# EAGLE design latch_circuit (EAGLE 9.5.2)
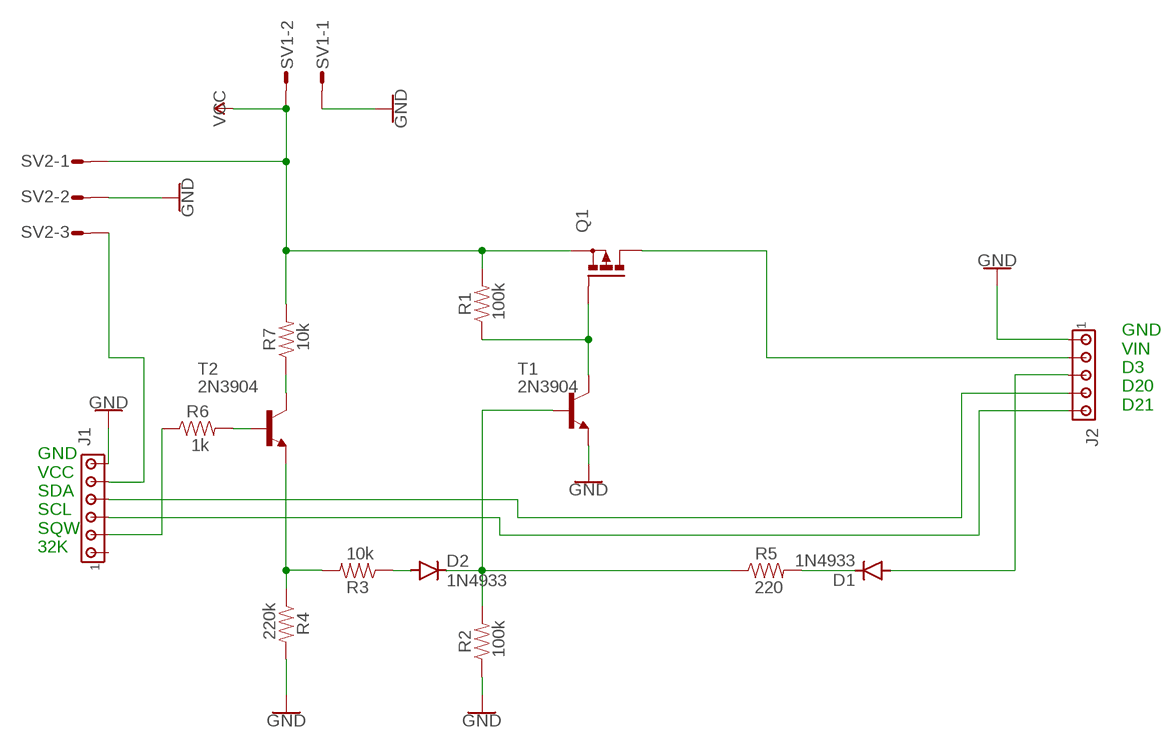
[diagram p0: schematic, sheet 1]

## Parts
D1  1N4933  [DO41-10]
D2  1N4933  [DO41-10]
J1  MTA06-100  [10X06MTA]
J2  MTA05-100  [10X05MTA]
Q1  PMOSFET_PTO220BH  [TO220BH]
R1  100k  RESISTORAXIAL-0.3  [AXIAL-0.3]
R2  100k  RESISTORAXIAL-0.3  [AXIAL-0.3]
R3  10k  RESISTORAXIAL-0.3  [AXIAL-0.3]
R4  220k  RESISTORAXIAL-0.3  [AXIAL-0.3]
R5  220  RESISTORAXIAL-0.3  [AXIAL-0.3]
R6  1k  RESISTORAXIAL-0.3  [AXIAL-0.3]
R7  10k  RESISTORAXIAL-0.3  [AXIAL-0.3]
SV1  S02P  [S02P]
SV2  S03P  [S03P]
T1  2N3904  [TO92]
T2  2N3904  [TO92]

## Nets
GND [New Class]: J1.6 J2.1 R2.P$1 R4.P$2 SV1.1 SV2.2 T1.3(E)
N$1 [New Class]: Q1.G R1.P$1 T1.1(C)
N$2 [New Class]: D2.A R3.P$1
N$3 [New Class]: J2.2 Q1.D
N$4 [New Class]: D2.C R2.P$2 R5.P$1 T1.2(B)
N$5 [New Class]: D1.C R5.P$2
N$6 [New Class]: D1.A J2.3
N$7: J1.2 R6.P$1
N$8 [New Class]: J1.5 SV2.3
N$9 [New Class]: J1.4 J2.4
N$10 [New Class]: J1.3 J2.5
N$11: R7.P$1 T2.1(C)
N$12: R6.P$2 T2.2(B)
N$13: R3.P$2 R4.P$1 T2.3(E)
VCC [New Class]: Q1.S R1.P$2 R7.P$2 SV1.2 SV2.1
Unconnected: J1.1

## Notes on the sheet
- GND
  VIN
  D3
  D20
  D21
- GND
  VCC
  SDA
  SCL
  SQW
  32K

## Library data of the parts
D1 D2 = diode:1N4933: DIODE fast recovery rectifier, 1A
J1 = con-amp:MTA06-100: AMP connector Connection corrected 2014-09-19
J2 = con-amp:MTA05-100: AMP connector
Q1 = transistor-power:PMOSFET_P: Power MOSFET P-Channel
R1-R7 = SparkFun-Resistors:RESISTOR: Generic Resistor Package
SV1 = con-amp-mt:S02P: AMP MT CONNECTOR; OC_FARNELL: unknown; OC_NEWARK: unknown
SV2 = con-amp-mt:S03P: AMP MT CONNECTOR; OC_FARNELL: unknown; OC_NEWARK: unknown
T1 T2 = transistor:2N3904: NPN TRANSISTOR

## Net classes
1 New Class: width 0.762 mm, clearance 0.508 mm

## Board
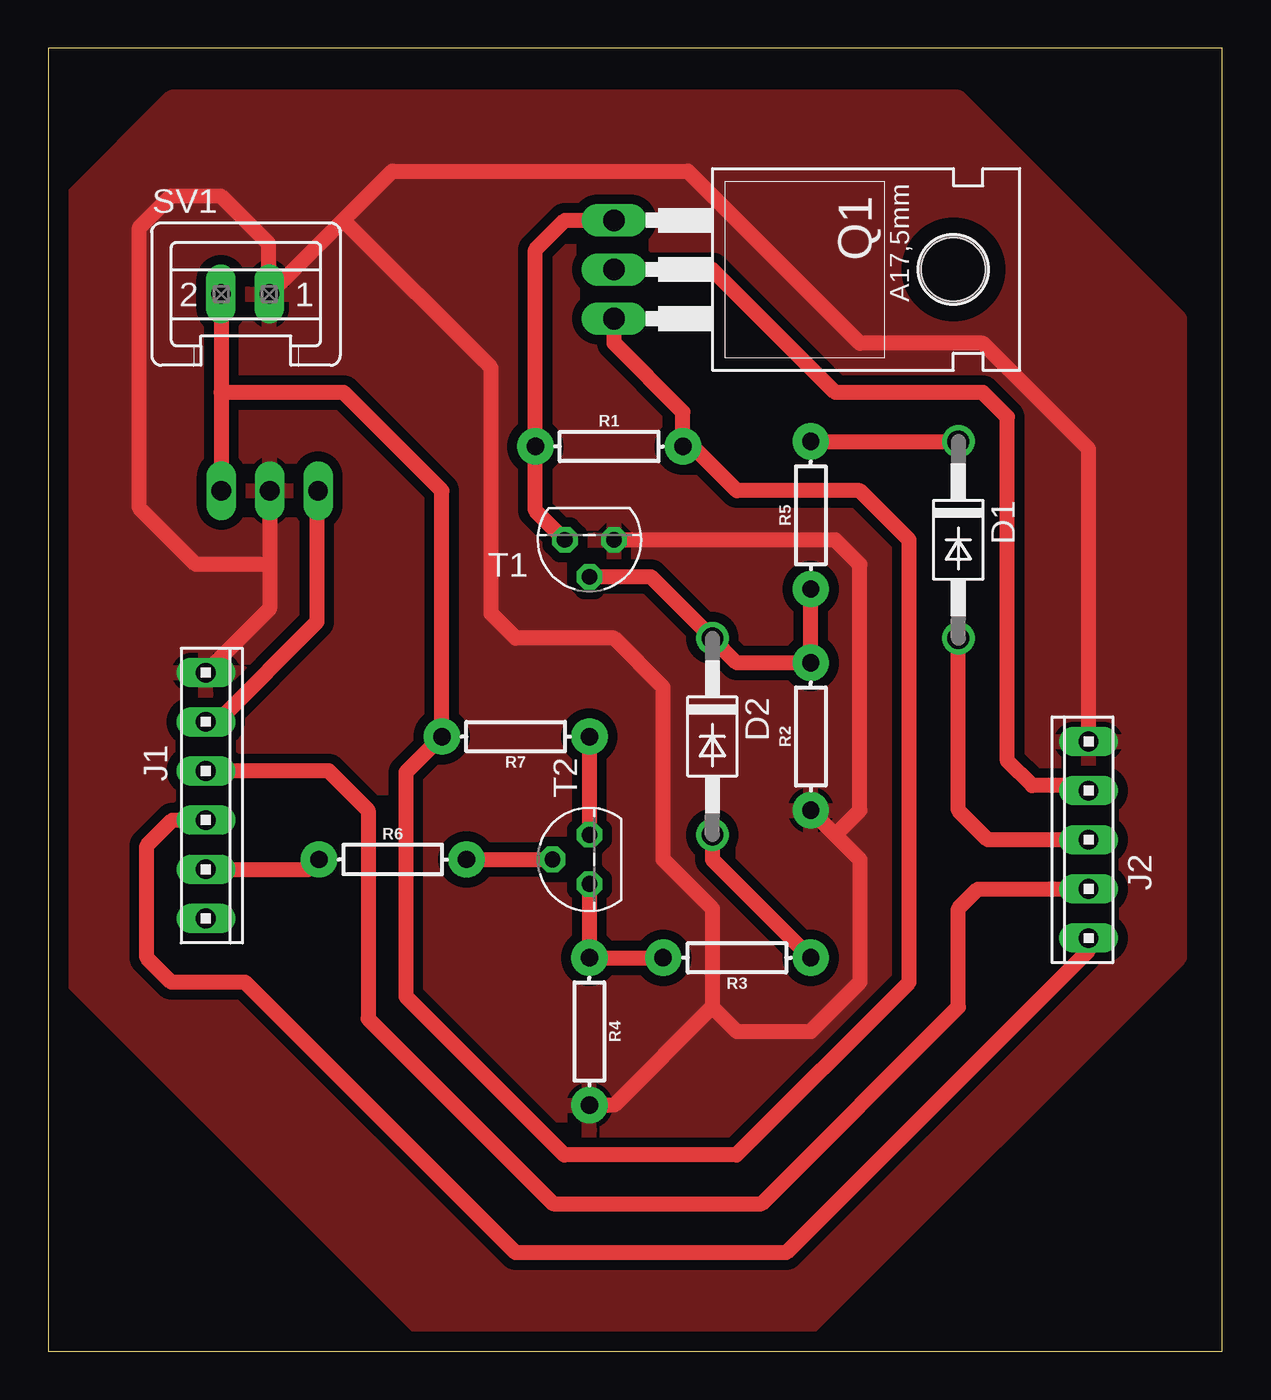
[diagram p1: board, top side]
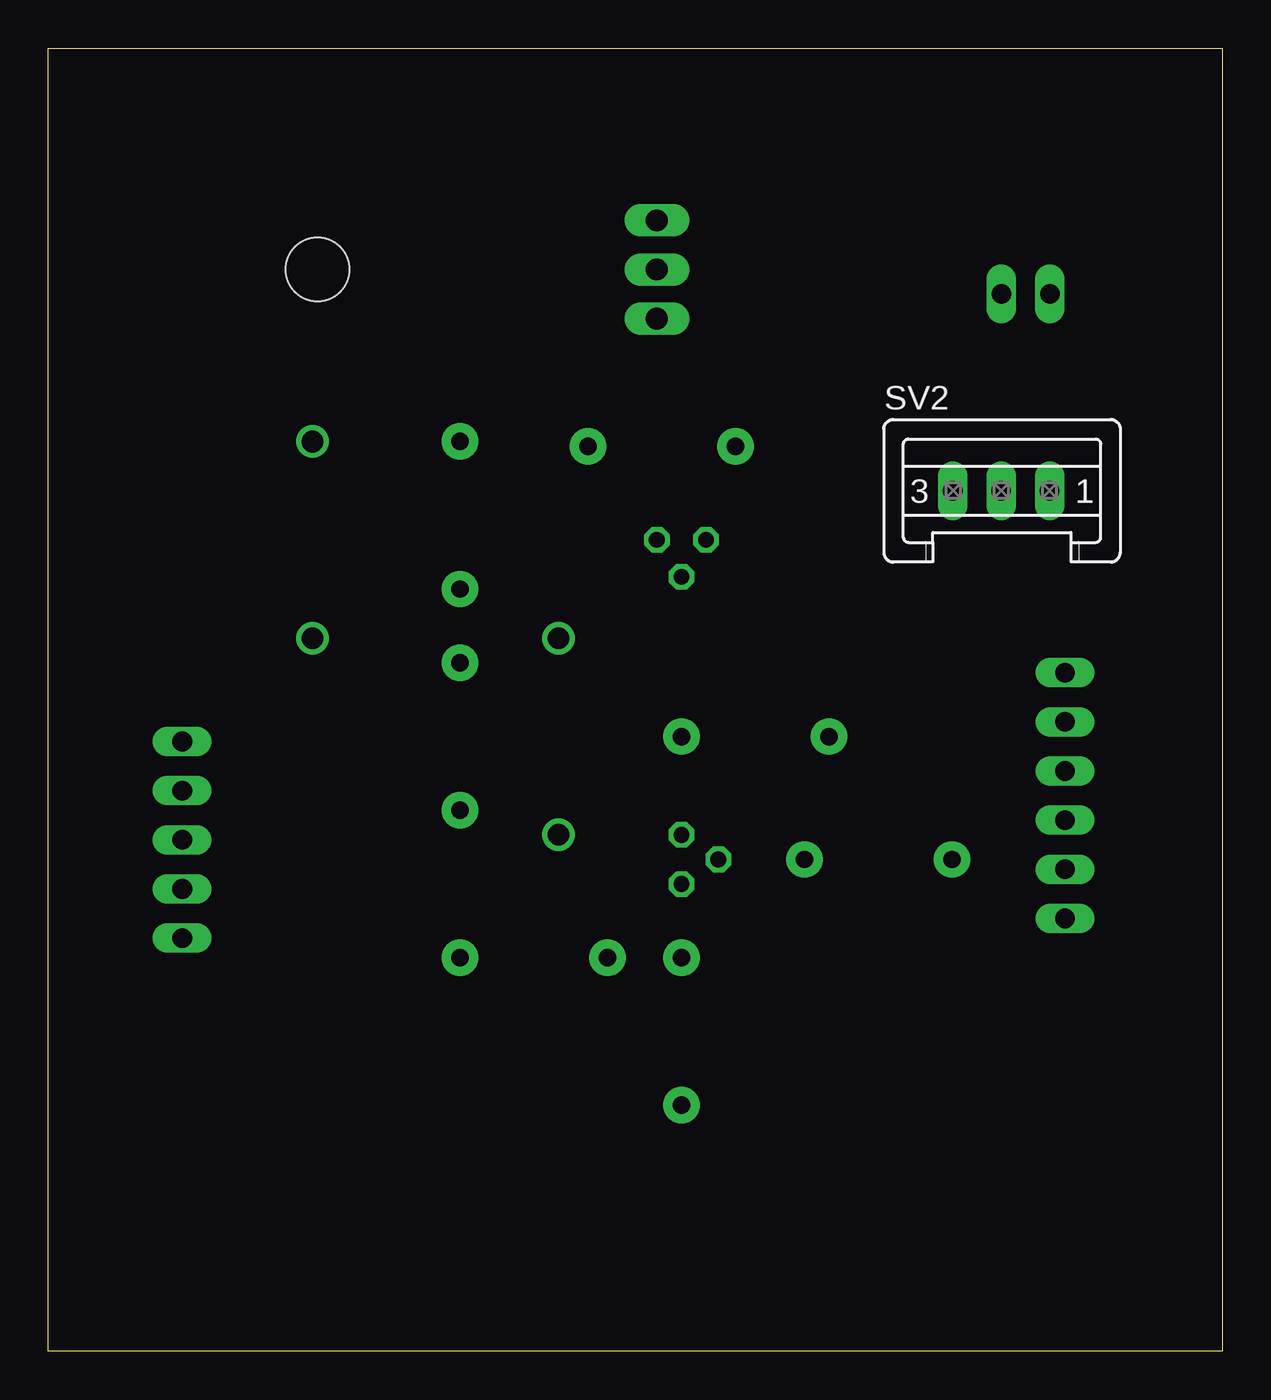
[diagram p2: board, bottom side, seen from below]

Size 60.63 x 67.3 mm. Coordinates in mm from the lower left corner, seen from the top.
Outline: 0,0 60.63,0 60.63,67.3 0,67.3 0,0
Copper layers (1*16): Top 0.035mm / dielectric 1.5mm / Bottom 0.035mm
Design rules "default": minimum track width 6mil, minimum drill 0.35mm, track to track 6mil, track to pad 6mil, pad to pad 6mil, via to via 6mil, smd to smd 6mil, copper to edge 40mil, drill to drill 6mil, minimum pad ring 10mil, minimum via ring 8mil, stop-mask expansion 4mil, vias tented up to drill 0mil, thermal gap 10mil

### Footprints (pad centres in the part's own frame; a part is rotated, then mirrored left to right if it is on the bottom)
DO41-10 = drill 1.118: A 5.08,0; C -5.08,0
10X06MTA = drill 1.016 long: 1 6.35,0; 2 3.81,0; 3 1.27,0; 4 -1.27,0; 5 -3.81,0; 6 -6.35,0
10X05MTA = drill 1.016 long: 1 5.08,0; 2 2.54,0; 3 0,0; 4 -2.54,0; 5 -5.08,0
TO220BH = drill 1.118 long: D 0,-6.35; G -2.54,-6.35; S 2.54,-6.35 | hole 3.302: 0,11.176
AXIAL-0.3 = drill 0.9 pad 1.88: P$1 -3.81,0; P$2 3.81,0
S02P = drill 1.016 long: 1 1.25,0; 2 -1.25,0
S03P = drill 1.016 long: 1 2.5,0; 2 0,0; 3 -2.5,0
TO92 = drill 0.813 octagon: 1 1.27,0; 2 0,1.905; 3 -1.27,0

### Placement (x,y rotation side)
D1  46.99,41.91 270 top
D2  34.29,31.75 270 top
J1  8.13,28.7 270 top
J2  53.72,26.42 90 top
Q1  35.56,55.88 270 top
R1  28.96,46.74 0 top
R2  39.37,31.75 90 top
R3  35.56,20.32 180 top
R4  27.94,16.51 270 top
R5  39.37,43.18 90 top
R6  17.78,25.4 0 top
R7  24.13,31.75 180 top
SV1  10.16,54.61 0 top
SV2  11.43,44.45 0 bottom
T1  27.94,41.91 180 top
T2  27.94,25.4 90 top

### Tracks (layer width: path | path; a pad name or v marks a point on that pad's centre or on a via)
GND
  Top 0.762: R2.P$1 40.64,26.67 | 40.64,26.67 41.91,25.4 41.91,19.05 39.37,16.51 35.56,16.51 34.29,17.78 | 11.43,40.64 SV2.2 11.43,43.81 | 11.43,40.64 11.43,38.35 J1.6 | 53.72,31.52 J2.1 53.72,46.61 48.26,52.07 41.91,52.07 33.02,60.96 17.76,60.96 15.23,58.43 | 11.43,40.64 7.62,40.64 4.7,43.56 4.7,58.04 6.35,59.69 8.89,59.69 11.35,57.23 11.35,54.61 SV1.1 15.23,58.43 | 34.29,17.78 34.29,22.86 31.75,25.4 31.75,34.29 29.21,36.83 24.13,36.83 22.86,38.1 22.86,50.8 15.23,58.43 | 34.29,17.78 29.21,12.7 R4.P$2 | 40.64,26.67 41.91,27.94 41.91,40.64 40.64,41.91 T1.3
  pour Top: 1.27,59.69 1.27,19.05 19.05,1.27 39.37,1.27 58.42,20.32 58.42,53.34 46.99,64.77 6.35,64.77
N$1
  Top 0.762: T1.1 25.15,43.43 R1.P$1 25.15,56.9 26.67,58.42 Q1.G
N$2
  Top 0.762: D2.A 34.29,25.4 R3.P$1
N$3
  Top 0.762: 53.72,29.01 J2.2 | J2.2 53.98,29.21 | J2.2 53.47,29.21 50.8,29.21 49.53,30.48 49.53,48.26 48.26,49.53 40.64,49.53 34.29,55.88 Q1.D
N$4
  Top 0.762: 39.06,35.74 R2.P$2 | T1.2 31.11,40.01 D2.C 35.56,35.56 R2.P$2 | R2.P$2 R5.P$1
N$5
  Top 0.762: R5.P$2 D1.C
N$6
  Top 0.762: J2.3 48.51,26.42 46.99,27.94 D1.A
N$7
  Top 0.152: 8.15,24.94 J1.2 | 13.95,25.4 R6.P$1
  Top 0.762: J1.2 13.46,24.89 R6.P$1
N$8
  Top 0.762: J1.5 8.15,32.56 8.76,32.56 13.87,37.67 13.87,44.42 SV2.3
N$9
  Top 0.762: J1.4 14.48,29.97 16.51,27.94 16.51,17.17 26.06,7.62 36.83,7.62 46.99,17.78 46.99,22.86 48.01,23.88 J2.4
N$10
  Top 0.762: 8.08,27.38 J1.3 6.4,27.43 5.08,26.11 5.08,20.32 6.35,19.05 10.16,19.05 24.13,5.08 38.1,5.08 53.72,20.7 J2.5
N$11
  Top 0.762: R7.P$1 T2.1
N$12
  Top 0.762: R6.P$2 T2.2
N$13
  Top 0.762: T2.3 R4.P$1 R3.P$2
VCC
  Top 0.762: 8.91,49.53 SV1.2 | 8.91,49.53 8.91,44.5 SV2.1 | 8.91,49.53 15.24,49.53 20.32,44.45 R7.P$2 18.47,29.9 18.47,18.31 26.64,10.13 35.53,10.13 44.45,19.05 44.45,41.91 41.91,44.45 35.56,44.45 33.02,46.99 R1.P$2 32.77,48.51 29.21,52.07 Q1.S